# Altium schematic sheet Power Input.SchDoc
size 297 x 209 mm; CompanyName: Sainsbury Wellcome Centre; Organization: FabLab; Address1: Sainsbury Wellcome Centre; Address2: 25 Howland Street; Address3: London; Address4: W1T 4JG; DocumentNumber: 2; SheetNumber: 2; SheetTotal: 14; swcgroup: FabLab; Org: Sainsbury Wellcome Centre; Add1: 25 Howland Street; Add2: London; Add3: W1T 4JG; WebAddress: www.sainsburywellcome.org; SheetSize: A4; SheetName: Power Input
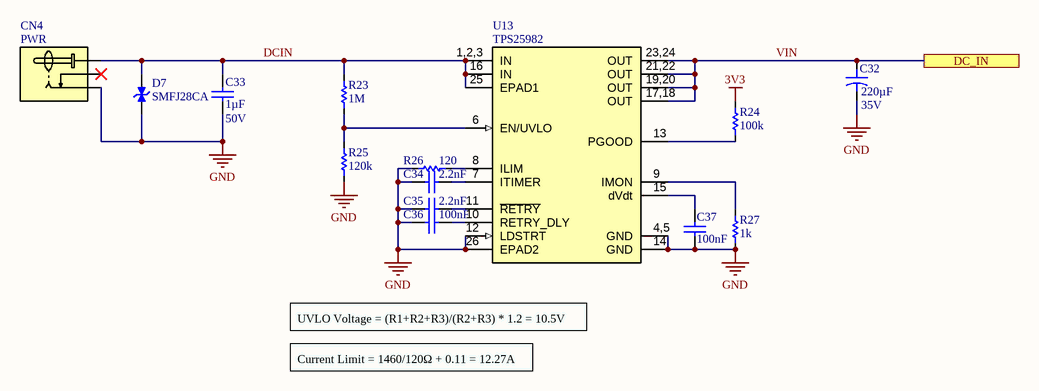
[diagram p0: Power Input.SchDoc]

## Parts
C32  value 220µF  Voltage Rating: 35V  [ECAP_SMD_D8_10.2L]  (hidden comment: SC8-220uF-35V)
C33  value 1µF  Voltage Rating: 50V  [CAP_CHIP_0603]  (hidden comment: C0603-1uF-50V)
C34  value 2.2nF  [CAP_CHIP_0603]  (hidden comment: C0603-2.2nF-50V)
C35  value 2.2nF  [CAP_CHIP_0603]  (hidden comment: C0603-2.2nF-50V)
C36  value 100nF  [CAP_CHIP_0603]  (hidden comment: C0603-100nF-50V)
C37  value 100nF  [CAP_CHIP_0603]  (hidden comment: C0603-100nF-50V)
CN4  PWR  [DC-005-2.0]
D7  SMFJ28CA  [SOD123]
R23  value 1M  [RES_CHIP_0603]  (hidden comment: R0603-1M)
R24  value 100k  [RES_CHIP_0603]  (hidden comment: R0603-100K)
R25  value 120k  [RES_CHIP_0603]  (hidden comment: R0603-120K)
R26  value 120  [RES_CHIP_0603]  (hidden comment: R0603-120R)
R27  value 1k  [RES_CHIP_0603]  (hidden comment: R0603-1K)
U13  TPS25982  [VQFN24]

## Ports
DC_IN

## Nets
3V3: R24.2
GND: C32.2 C33.1 C34.2 C35.2 C36.2 C37.1 CN4.2(Ring) D7.1(K) R25.1 R26.2 R27.1 U13.4,5(GND) U13.12(LDSTRT) U13.14(GND) U13.26(EPAD2)
DCIN: C33.2 CN4.1(Center) D7.2(A) R23.2 U13.1,2,3(IN) U13.16(IN) U13.25(EPAD1)
VIN: C32.1 U13.17,18(OUT) U13.19,20(OUT) U13.21,22(OUT) U13.23,24(OUT) ; port DC_IN
NetC34_1: C34.1 U13.7(ITIMER)
NetC35_1: C35.1 U13.11(~{RETRY})
NetC36_1: C36.1 U13.10(RETRY_DLY)
NetC37_2: C37.2 U13.15(dVdt)
NetR23_1: R23.1 R25.2 U13.6(EN/UVLO)
NetR24_1: R24.1 U13.13(PGOOD)
NetR26_1: R26.1 U13.8(ILIM)
NetR27_2: R27.2 U13.9(IMON)

Not connected (* = marked no-connect by the designer): CN4 3(Detect)*

## Notes on the sheet
- UVLO Voltage = (R1+R2+R3)/(R2+R3) * 1.2 = 10.5V
- Current Limit = 1460/120Ω + 0.11 = 12.27A
- FILE
- VARIANT
- DATE
- REVISION
- SHEET
- /
- PROJECT
- SIZE

## Library data of the parts
C32 = CMP-612-0005-5: Cap Aluminum Polymer 220uF 35V 20% Cylindrical 27m Ohm 2000mA 4000 hr 125°C Emboss T/R; PartNumber: EEHZK1V221UP; Pick&PlaceFootprint: EC8; ESR (Equivalent Series Resistance): 17mR; Capacitor Type: Solid; Ripple Current: 2A; LCSC Part N.: C454287; Mount: Surface Mount; Height: 10.5mm; Tolerance: 20%
C33 = CMP-611-0033-11: 0603 Multilayer Ceramic Capacitors MLCC; PartNumber: CL10A105KB8NNNC; Pick&PlaceFootprint: C0603; Dielectric: X5R; Tolerance: 10%; Case/Package: 0603; LCSC Part N.: C15849; RoHS: Yes; Mount: SMD; Capacitor Type: Ceramic
C34 C35 = CMP-611-0074-1: 0603 Multilayer Ceramic Capacitors MLCC; PartNumber: 0603B222K500NT; Voltage Rating: 50V; Pick&PlaceFootprint: C0603; Tolerance: 10%; Dielectric: X7R; Case/Package: 0603; RoHS: Yes; Mount: SMD; Capacitor Type: Ceramic; LCSC Part N.: C1604
C36 C37 = CMP-611-0027-24: 0603 Multilayer Ceramic Capacitors MLCC; PartNumber: CC0603KRX7R9BB104; Tolerance: 10%; Pick&PlaceFootprint: C0603; Dielectric: X7R; Voltage Rating: 50V; Capacitor Type: Ceramic; RoHS: Yes; Mount: SMD; LCSC Part N.: C14663; Case/Package: 0603
CN4 = CMP-360-0005-6: Surface Mount, Right Angle 2.5A 24V SMD DC Power Connector; PartNumber: DC-005-2.5A-2.0-SMT; Connector Type: Jack,Power; Pitch: 2.0mm; Gender: Male; Contact Plating: Tin; Voltage Rating: 24V; Contact Material: Copper Alloy; Current Rating: 2.5A; Mount: Surface Mount; LCSC Part N.: C2880543; Orientation: Horizontal
D7 = CMP-210-0002-1: 4.4A 45.4V@4.4A 200W 31.1V Bi-Directional 28V SOD-123F Electrostatic and Surge Protection (TVS/ESD); Breakdown Voltage: 31V; Clamp Voltage: 45.4V; PartNumber: SMFJ28CA; Stand-off Voltage: 28V; Pick&PlaceFootprint: SOD-123; Mount: Surface Mount; LCSC Part N.: C5125651
R23 = CMP-633-0066-20: 100mW Thick Film Resistors 75V ±100ppm/℃ ±1% 0603 Chip Resistor; PartNumber: 0603WAF1004T5E; Number of Resistors: 1; Pick&PlaceFootprint: R0603; Voltage Rating: 75V; Mount: Surface Mount; LCSC Part N.: C22935; Power Rating: 100mW; Tolerance: 1%; Case/Package: 0603
R24 = CMP-633-0000-28: 100mW Thick Film Resistors 75V ±100ppm/℃ ±1% 0603 Chip Resistor; PartNumber: 0603WAF1003T5E; Number of Resistors: 1; Pick&PlaceFootprint: R0603; LCSC Part N.: C25803; Mount: Surface Mount; Voltage Rating: 75V; Power Rating: 100mW; Case/Package: 0603; Tolerance: 1%
R25 = CMP-633-0146-1: 100mW Thick Film Resistors 75V ±100ppm/℃ ±1% 0603 Chip Resistor; PartNumber: 0603WAF1203T5E; Number of Resistors: 1; Pick&PlaceFootprint: R0603; Voltage Rating: 75V; Mount: Surface Mount; Tolerance: 1%; LCSC Part N.: C25808; Power Rating: 100mW; Case/Package: 0603
R26 = CMP-633-0100-12: 100mW Thick Film Resistors 75V ±100ppm/℃ ±1% 0603 Chip Resistor; PartNumber: 0603WAF1200T5E; Pick&PlaceFootprint: R0603; Number of Resistors: 1; Mount: Surface Mount; Tolerance: 1%; Voltage Rating: 75V; Case/Package: 0603; Power Rating: 100mW; LCSC Part N.: C22787
R27 = CMP-633-0013-26: 100mW Thick Film Resistors 75V ±100ppm/℃ ±1% 0603 Chip Resistor; PartNumber: 0603WAF1001T5E; Pick&PlaceFootprint: R0603; Number of Resistors: 1; Voltage Rating: 75V; Case/Package: 0603; Tolerance: 1%; Mount: Surface Mount; LCSC Part N.: C21190; Power Rating: 100mW
U13 = CMP-970-0065-3: Smart Electronic Fuse with Accurate Load Current Monitor 2.7mOhm 15A 2.7V to 24V 24-Pin VQFN T/R; PartNumber: TPS259827ONRGET; RdsOn: 2.7mR; Accuracy: 1.5%; Min Vin: 2.7V; Output Current: 15A; LCSC Part N.: C2155765; Max Vin: 24V